# EasyEDA schematic SCH_STM32 Blue Pill_2022-05-05.json
TITLE: STM32 Blue Pill closed stepper controller; REV: 0.1; Date: 2021-12-12; Sheet: 1/1
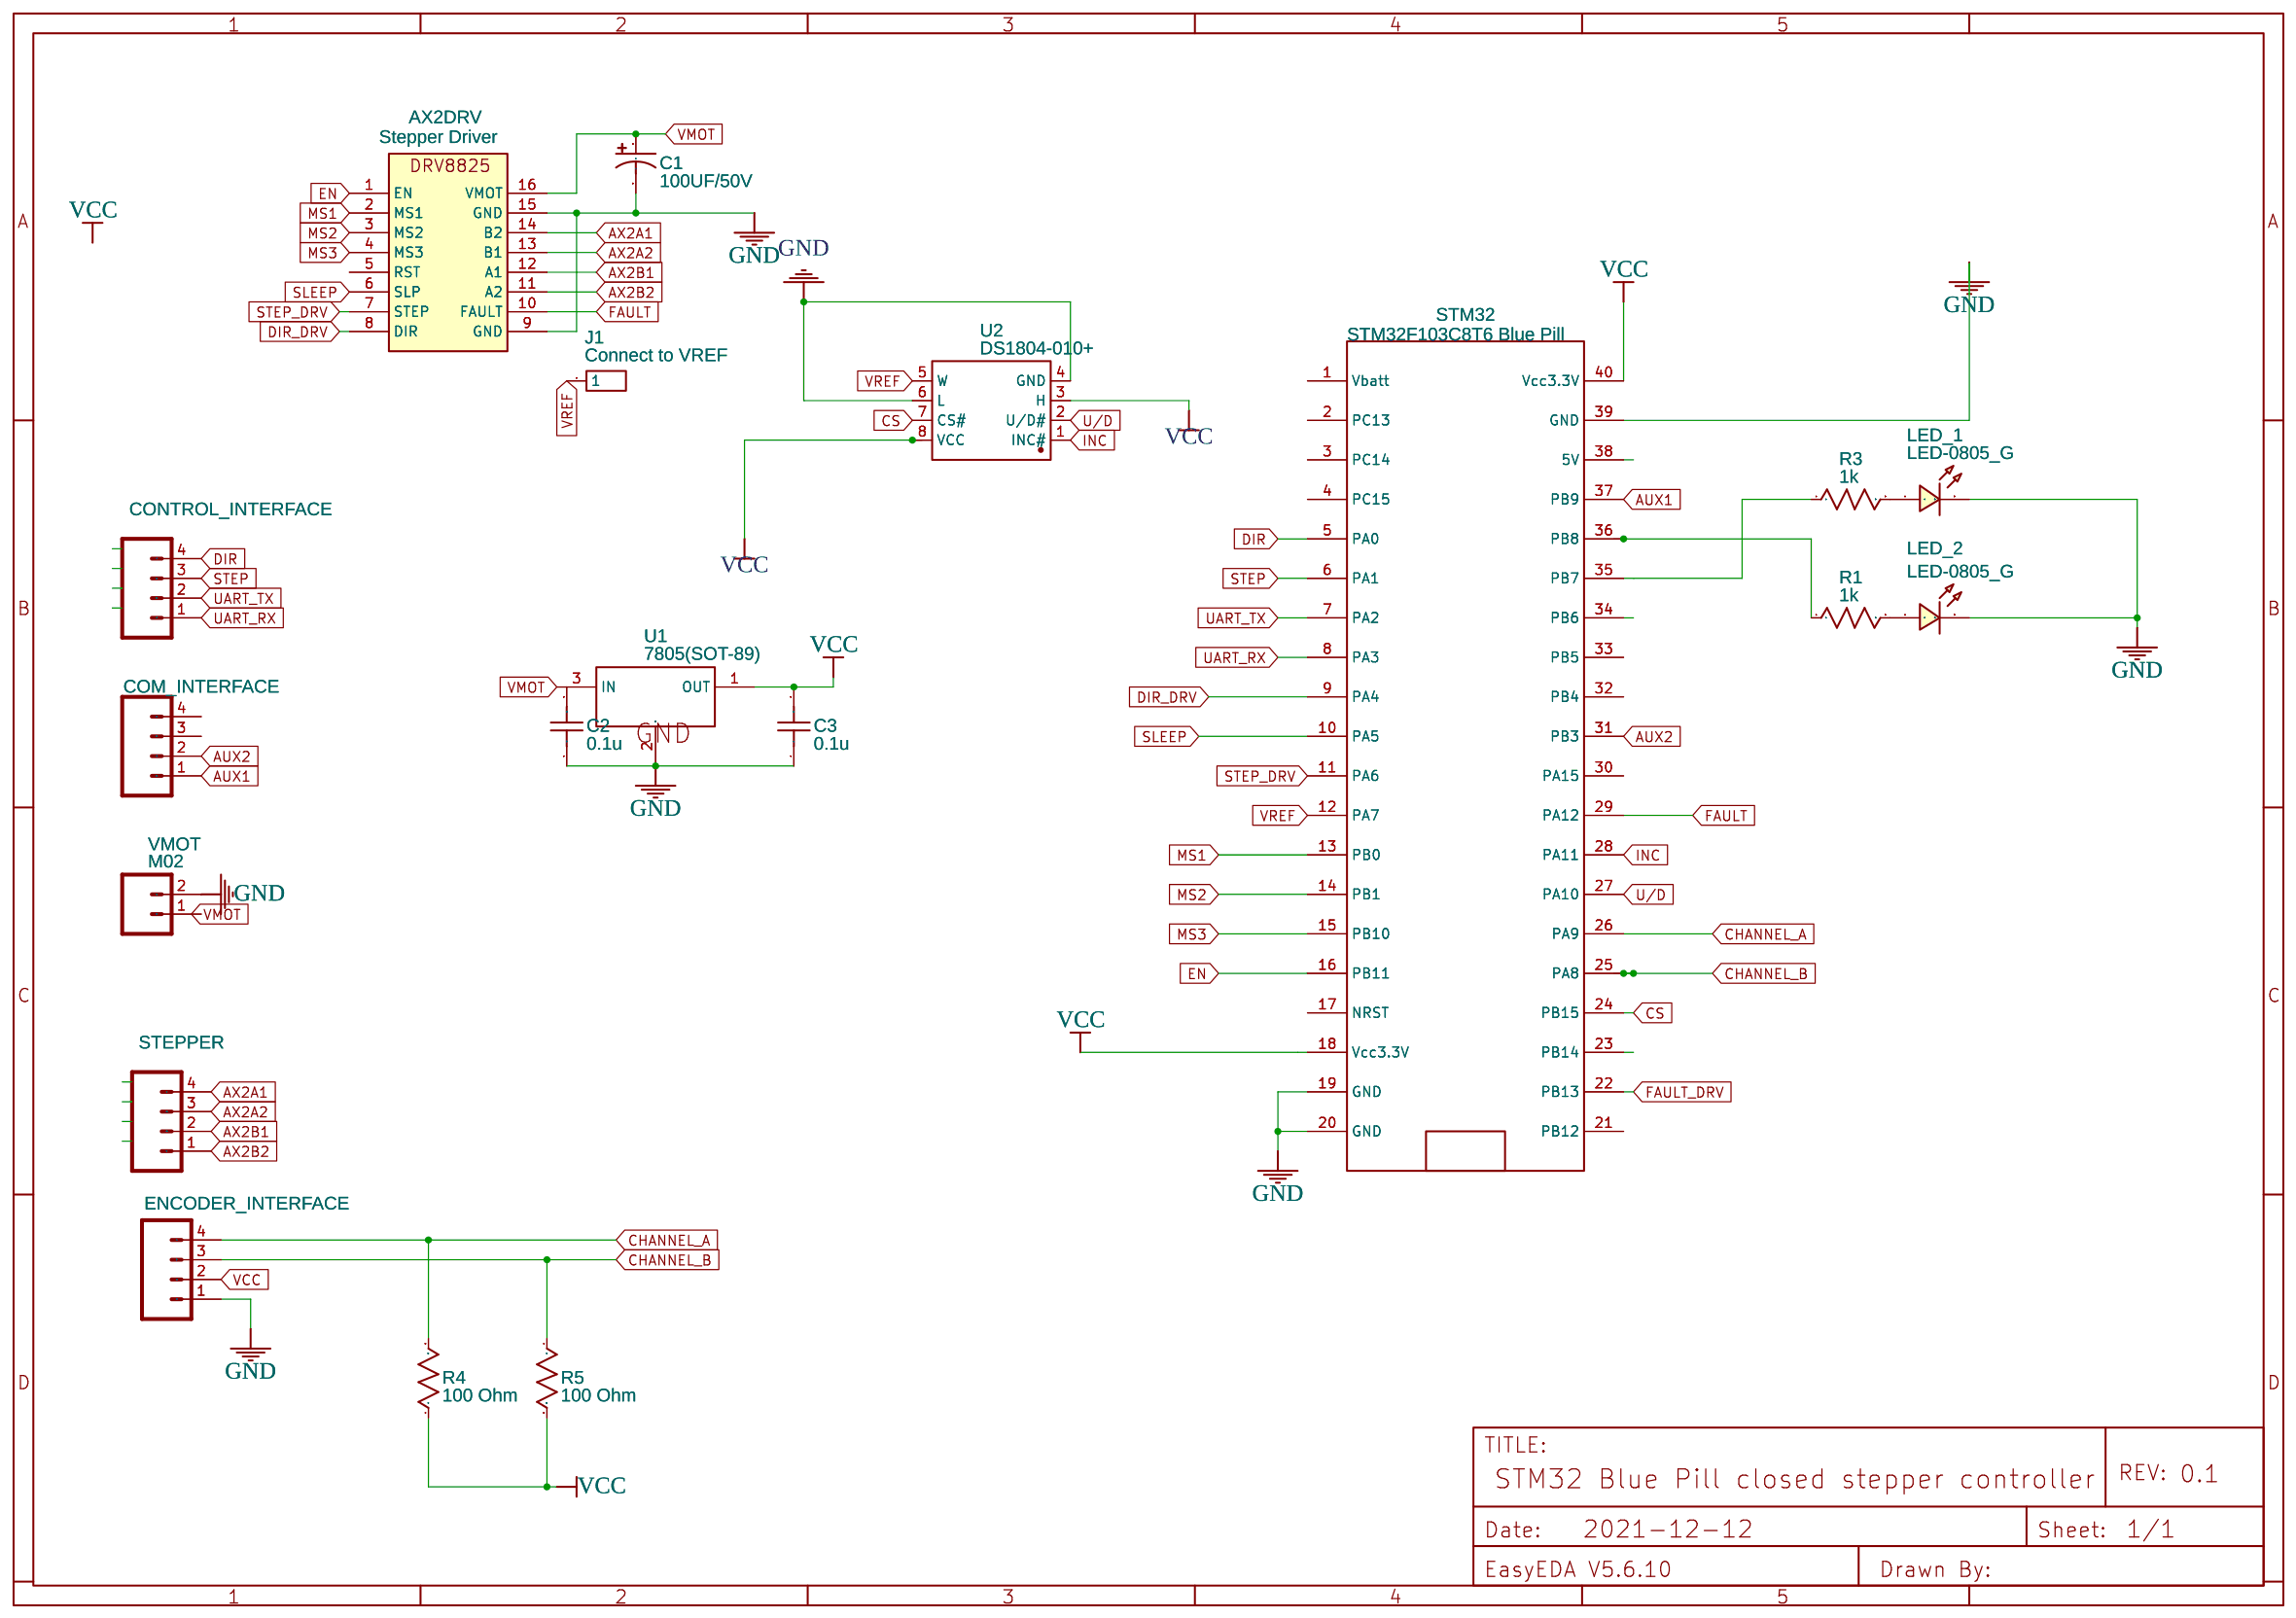
[diagram p0: schematic sheet]

## Parts
AX2DRV  Stepper Driver  [DRV8825 STEPPER MOTOR DRIVER CARRIER]
C1  100UF/50V  [CAP  8MM]
C2  0.1u  [C0603]
C3  0.1u  [C0603]
COM_IF  COM_INTERFACE  [MOLEX-1X4]
CTR_IF  CONTROL_INTERFACE  [MOLEX-1X4]
ENC_IF  ENCODER_INTERFACE  [MOLEX-1X4]
J1  Connect to VREF  [HDR-M-2.54_1X1]
LED_1  LED-0805_G  [LED0805_GREEN]
LED_2  LED-0805_G  [LED0805_GREEN]
R1  1k  [R0603]
R3  1k  [R0603]
R4  100 Ohm  [R0603]
R5  100 Ohm  [R0603]
STM32  STM32F103C8T6 Blue Pill  [STM32F103C8T6-BLUEPILL]
STP  STEPPER  [MOLEX-1X4]
U1  7805(SOT-89)  [SOT-89-3_L4.5-W2.5-P1.50-LS4.2-BR]
U2  DS1804-010+  [PDIP-8_L9.5-W6.6-P2.54-LS8.0-BL]
VMOT  M02  [MOLEX-1X2]

## Library data of the parts
AX2DRV = DRV8825 Stepper Motor Driver Carrier: Contributor: winter2015; sourceId: YsmgyP7pj
C1 = 100UF/50V: CAP-07890; Contributor: SparkFun; sourceId: 6c97tPN9v
C2 C3 = C_0603_US: Contributor: LCEDA_Lib
COM_IF CTR_IF ENC_IF STP = M04: Contributor: SparkFun; Supplier: RS-Online
J1 = HDR-M-2.54_1x1: Supplier Part: C81276; Supplier: RS-Online; Contributor: LCEDA_Lib
LED_1 LED_2 = LED-0805_G: Manufacturer: 国星光电; Manufacturer Part: NCD0805G1; Supplier Part: C84260; Supplier: RS-Online; Contributor: LCEDA_Lib
R1 R3-R5 = R_0603_US: Supplier: RS-Online; Contributor: LCEDA_Lib
STM32 = STM32F103C8T6 Generic Development Board: Manufacturer Part: STM32Duino; Contributor: zsteva
U1 = 7805(SOT-89): Supplier: RS-Online; Manufacturer: CJ; Manufacturer Part: CJ78L05; image: //image.lceda.cn/szlcsc/C2079.jpg; Supplier Part: C2079; Paste Type: expand; Contributor: LCEDA_Lib
U2 = DS1804-010+: Supplier: LCSC; Supplier Part: C1520917; Manufacturer: MAXIM(美信); Contributor: LCSC
VMOT = M02: Contributor: SparkFun

## Nets
GND: AX2DRV.9(GND) AX2DRV.15(GND) C1.2(-) C2.1 C3.1 ENC_IF.1 LED_1.2 LED_2.2 STM32.19(GND) STM32.20(GND) STM32.39(GND) U1.2(GND) U2.4(GND) U2.6(L) VMOT.2
VCC: C3.2 ENC_IF.2 R4.1 R5.2 STM32.18(Vcc3.3V) STM32.40(Vcc3.3V) U1.1(OUT) U2.3(H) U2.8(VCC)
AUX1: COM_IF.1 STM32.37(PB9)
AUX2: COM_IF.2 STM32.31(PB3)
AX2A1: AX2DRV.14(B2) STP.4
AX2A2: AX2DRV.13(B1) STP.3
AX2B1: AX2DRV.12(A1) STP.2
AX2B2: AX2DRV.11(A2) STP.1
CHANNEL_A: ENC_IF.4 R4.2 STM32.26(PA9)
CHANNEL_B: ENC_IF.3 R5.1 STM32.25(PA8)
CS: STM32.24(PB15) U2.7(CS#)
DIR: CTR_IF.4 STM32.5(PA0)
DIR_DRV: AX2DRV.8(DIR) STM32.9(PA4)
EN: AX2DRV.1(EN) STM32.16(PB11)
FAULT: AX2DRV.10(FAULT) STM32.29(PA12)
FAULT_DRV: STM32.22(PB13)
INC: STM32.28(PA11) U2.1(INC#)
MS1: AX2DRV.2(MS1) STM32.13(PB0)
MS2: AX2DRV.3(MS2) STM32.14(PB1)
MS3: AX2DRV.4(MS3) STM32.15(PB10)
SLEEP: AX2DRV.6(SLP) STM32.10(PA5)
STEP: CTR_IF.3 STM32.6(PA1)
STEP_DRV: AX2DRV.7(STEP) STM32.11(PA6)
U/D: STM32.27(PA10) U2.2(U/D#)
UART_RX: CTR_IF.1 STM32.8(PA3)
UART_TX: CTR_IF.2 STM32.7(PA2)
VMOT: AX2DRV.16(VMOT) C1.1(+) U1.3(IN)
VREF: J1.1 STM32.12(PA7) U2.5(W)
Net-(LED_1-1): LED_1.1 R3.2
Net-(LED_2-1): LED_2.1 R1.2
Net-(R1-1): R1.1 STM32.36(PB8)
Net-(R3-1): R3.1 STM32.35(PB7)

Not connected (* = marked no-connect by the designer): AX2DRV 5(RST); C2 2; COM_IF 3 4; STM32 1(Vbatt) 2(PC13) 3(PC14) 4(PC15) 17(NRST) 21(PB12) 23(PB14) 30(PA15) 32(PB4) 33(PB5) 34(PB6) 38(5V); VMOT 1
